# EAGLE schematic ESP32 Miner LCD-2.8 inch V1.0 251225(1) (EAGLE 9.5.1)
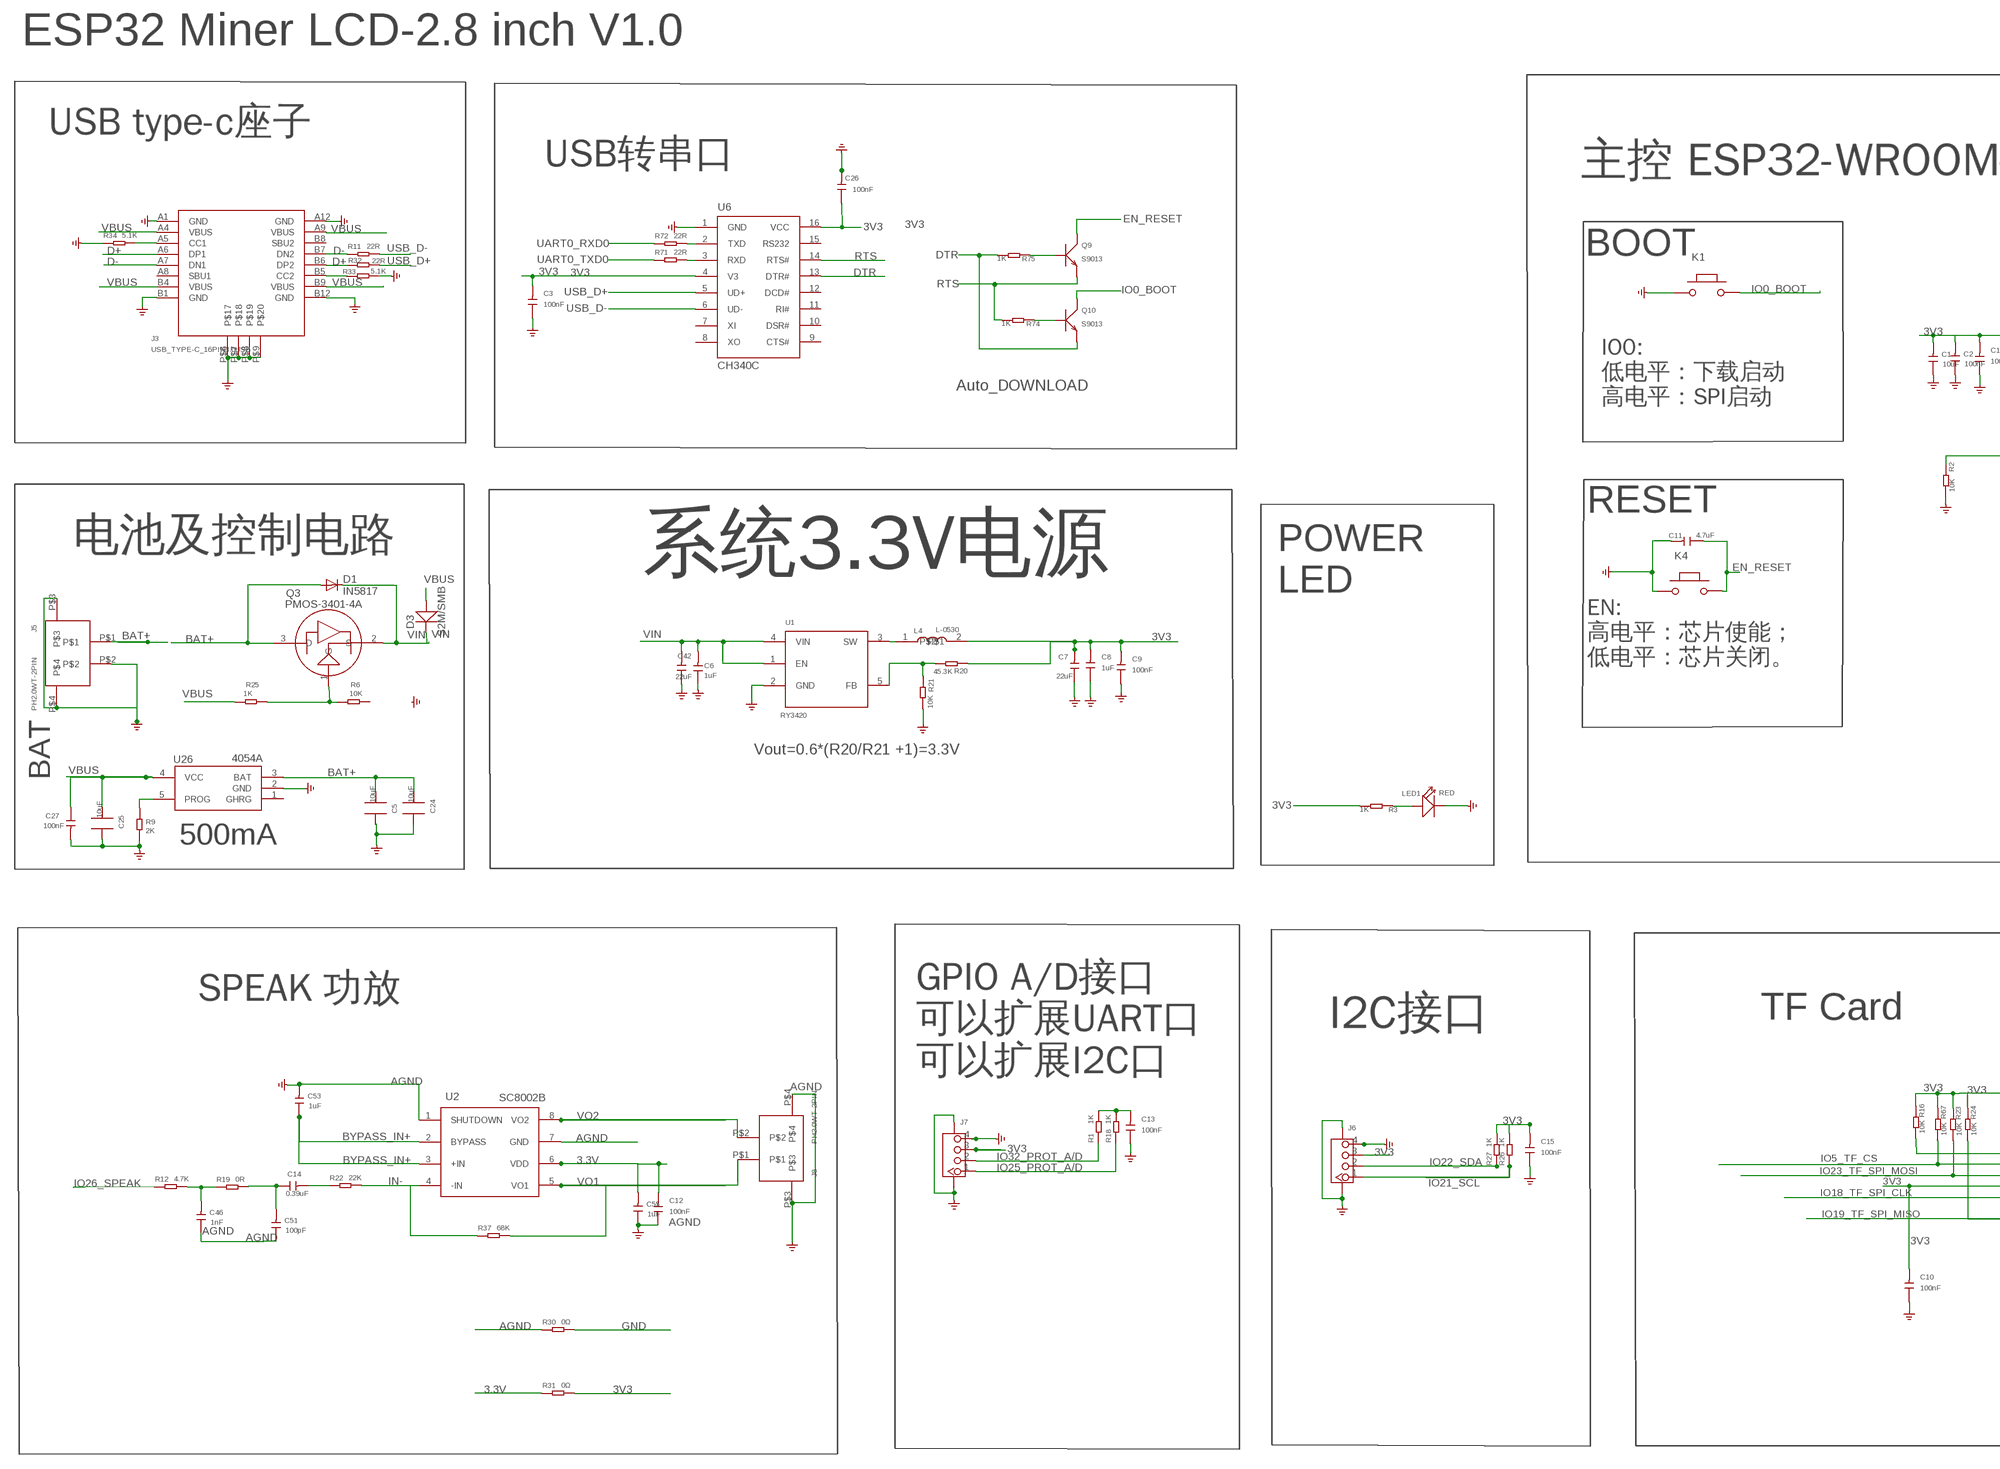
[diagram p0: schematic, sheet 1, part 1 of 2]
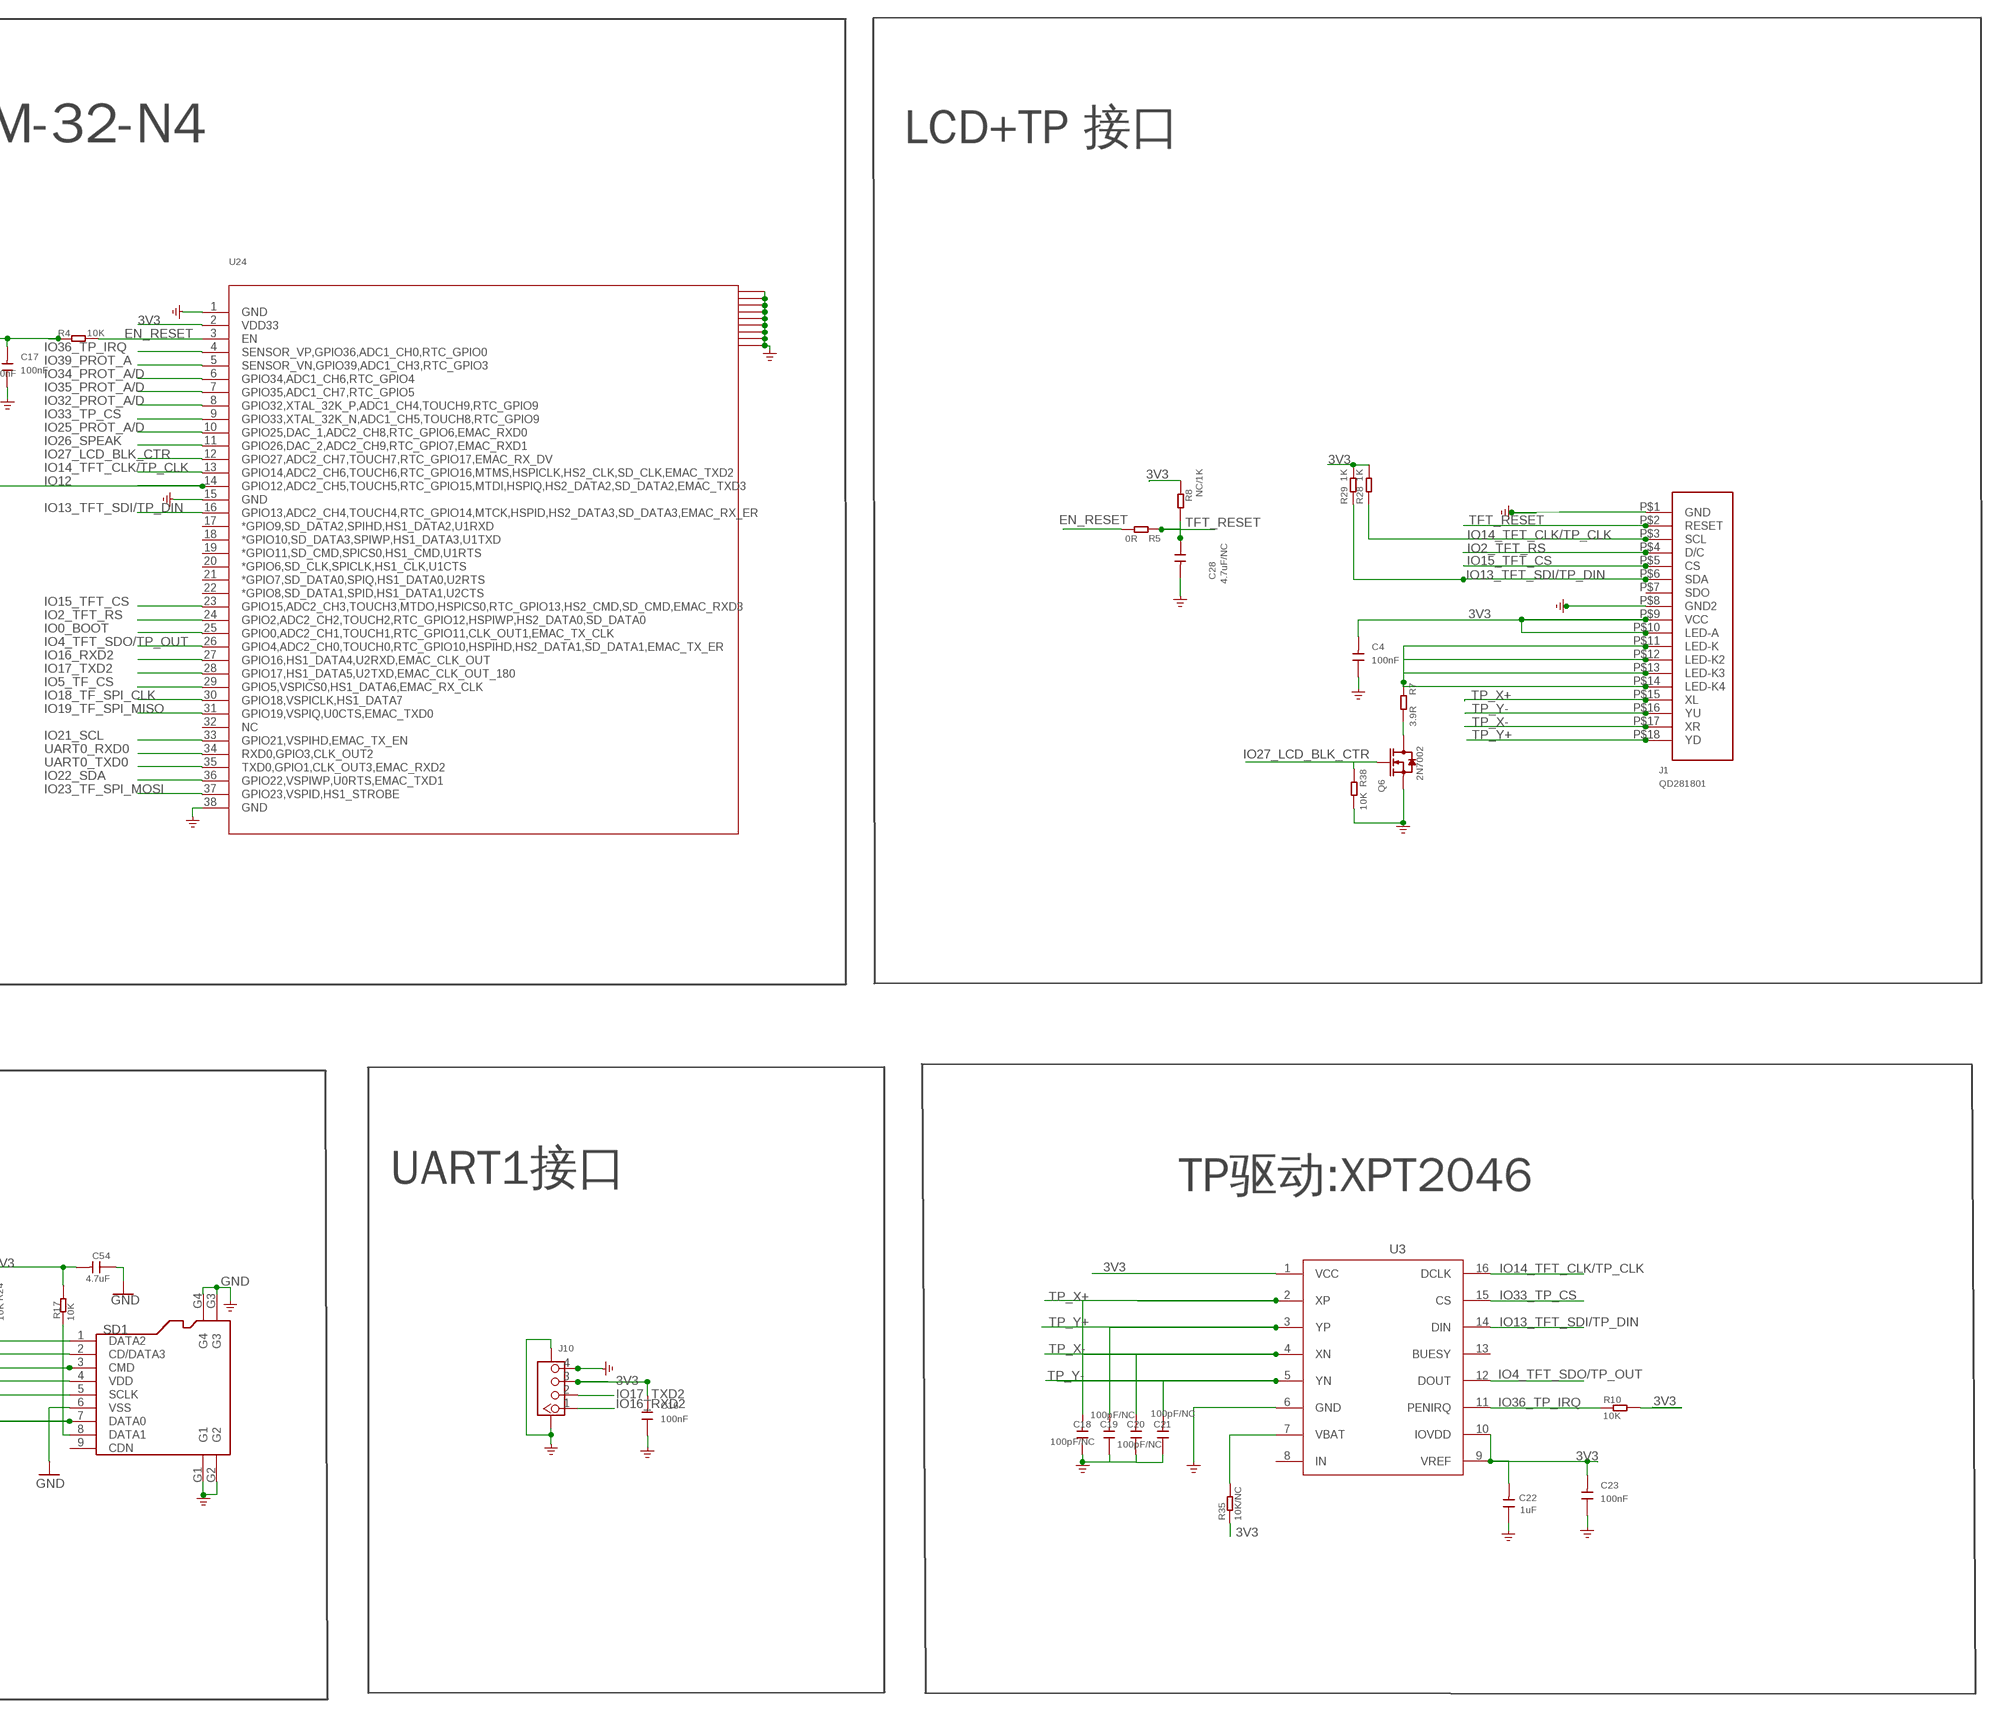
[diagram p1: schematic, sheet 1, part 2 of 2]

## Parts
C1  10uF  DISCRETE_C-0603  [DISCRETE_C0603]
C2  100nF  DISCRETE_C-0603  [DISCRETE_C0603]
C3  100nF  C0603  [0603]
C4  100nF  C0603  [0603]
C5  10uF  C0805_S  [0805_S]
C6  1uF  C0603  [0603]
C7  22uF  C0805  [0805]
C8  1uF  C0603  [0603]
C9  100nF  C0603  [0603]
C10  100nF  C0603  [0603]
C11  4.7uF  C0603  [0603]
C12  100nF  C0603  [0603]
C13  100nF  C0603  [0603]
C14  0.39uF  DISCRETE_C-0603  [DISCRETE_C0603]
C15  100nF  C0603  [0603]
C16  100nF  C0603  [0603]
C17  100nF  C0603  [0603]
C18  100pF/NC  C0603  [0603]
C19  100pF/NC  C0603  [0603]
C20  100pF/NC  C0603  [0603]
C21  100pF/NC  C0603  [0603]
C22  1uF  DISCRETE_C-0603  [DISCRETE_C0603]
C23  100nF  C0603  [0603]
C24  10uF  C0805_S  [0805_S]
C25  10uF  C0805_S  [0805_S]
C26  100nF  C0603  [0603]
C27  100nF  C-0603  [C0603]
C28  4.7uF/NC  C0603  [0603]
C42  22uF  C0805  [0805]
C46  1nF  DISCRETE_C-0603  [DISCRETE_C0603]
C51  100pF  DISCRETE_C-0603  [DISCRETE_C0603]
C53  1uF  DISCRETE_C-0603  [DISCRETE_C0603]
C54  4.7uF  DISCRETE_C-0603  [DISCRETE_C0603]
C55  1uF  DISCRETE_C-0603  [DISCRETE_C0603]
D1  IN5817  DIODE-DO-214AC  [DO-214AC]
D3  S2M/SMB  214ABDO-214AB  [214AB]
J1  QD281801  [QD241801-18PIN*0.8]
J3  USB_TYPE-C_16PIN3.0USB  [KEVIN_3.0TYPEC-SMD]
J5  PH2.0WT-2PIN  [PH2.0WT-2PIN]
J6  CONNECTOR_TWIG-4P-2.0-SMD-FEMALE-REINFORCE90D  [CONNECTOR_4P-SMD-2.0-90D]
J7  CONNECTOR_TWIG-4P-2.0-SMD-FEMALE-REINFORCE90D  [CONNECTOR_4P-SMD-2.0-90D]
J8  PH2.0WT-2PIN  [PH2.0WT-2PIN]
J10  CONNECTOR_TWIG-4P-2.0-SMD-FEMALE-REINFORCE90D  [CONNECTOR_4P-SMD-2.0-90D]
K1  BUTTON  PB157  [157SW]
K4  BUTTON  PB157  [157SW]
L4  L-0530  [CD54_CD54]
LED1  RED  DISCRETE_LED0603  [DISCRETE_LED-0603]
Q3  PMOS-3401-4A  P-MOS-SOT23  [SOT-23]
Q6  2N7002  MOSFET-N'SOT23'  [SOT23]
Q9  S9013  TRANSISTOR-NPN-SOT23  [SOT23@1]
Q10  S9013  TRANSISTOR-NPN-SOT23  [SOT23@1]
R1  1K  DISCRETE_R-0603  [DISCRETE_R0603]
R2  10K  DISCRETE_R-0603  [DISCRETE_R0603]
R3  1K  DISCRETE_R-0603  [DISCRETE_R0603]
R4  10K  R0603  [R0603]
R5  0R  DISCRETE_R-0603  [DISCRETE_R0603]
R6  10K  DISCRETE_R-0603  [DISCRETE_R0603]
R7  3.9R  DISCRETE_R-0603  [DISCRETE_R0603]
R8  NC/1K  DISCRETE_R-0603  [DISCRETE_R0603]
R9  2K  DISCRETE_R-0603  [DISCRETE_R0603]
R10  10K  DISCRETE_R-0603  [DISCRETE_R0603]
R11  22R  DISCRETE_R-0603  [DISCRETE_R0603]
R12  4.7K  DISCRETE_R-0603  [DISCRETE_R0603]
R16  10K  DISCRETE_R-0603  [DISCRETE_R0603]
R17  10K  DISCRETE_R-0603  [DISCRETE_R0603]
R18  1K  DISCRETE_R-0603  [DISCRETE_R0603]
R19  0R  DISCRETE_R-0603  [DISCRETE_R0603]
R20  45.3K  DISCRETE_R-0603  [DISCRETE_R0603]
R21  10K  DISCRETE_R-0603  [DISCRETE_R0603]
R22  22K  DISCRETE_R-0603  [DISCRETE_R0603]
R23  10K  DISCRETE_R-0603  [DISCRETE_R0603]
R24  10K  DISCRETE_R-0603  [DISCRETE_R0603]
R25  1K  DISCRETE_R-0603  [DISCRETE_R0603]
R26  1K  DISCRETE_R-0603  [DISCRETE_R0603]
R27  1K  DISCRETE_R-0603  [DISCRETE_R0603]
R28  1K  DISCRETE_R-0603  [DISCRETE_R0603]
R29  1K  DISCRETE_R-0603  [DISCRETE_R0603]
R30  0Ω  DISCRETE_R-0603  [DISCRETE_R0603]
R31  0Ω  DISCRETE_R-0603  [DISCRETE_R0603]
R32  22R  DISCRETE_R-0603  [DISCRETE_R0603]
R33  5.1K  DISCRETE_R-0603  [DISCRETE_R0603]
R34  5.1K  DISCRETE_R-0603  [DISCRETE_R0603]
R35  10K/NC  DISCRETE_R-0603  [DISCRETE_R0603]
R37  68K  DISCRETE_R-0603  [DISCRETE_R0603]
R38  10K  DISCRETE_R-0603  [DISCRETE_R0603]
R67  10K  DISCRETE_R-0603  [DISCRETE_R0603]
R71  22R  DISCRETE_R-0603  [DISCRETE_R0603]
R72  22R  DISCRETE_R-0603  [DISCRETE_R0603]
R74  1K  DISCRETE_R-0603  [DISCRETE_R0603]
R75  1K  DISCRETE_R-0603  [DISCRETE_R0603]
SD1  HOLDER-MICROSD-9P  [9P-SMD-W/-RING]
U1  RY3420  A_XBJ_HM3420B  [A_XBJ_SOT23-5]
U2  SC8002B  SC8002BSC8002B-SOP8  [AT24C02_SOP8]
U3  XP2046  [XP2046-SSOP16]
U6  CH340C  CH340G  [SOP-16]
U24  ESP32-WROOM-32-N4  [ESP32-WROOM-32-N4]
U26  4054A  [SOP23-5]

## Nets
3.3V: C12.2 C55.2 R31.1 U2.6(VDD)
3V3: C1.2 C2.2 C3.2 C4.2 C7.2 C8.2 C9.2 C10.2 C13.2 C15.2 C16.2 C17.2 C22.2 C23.2 C26.1 C54.2 J1.P$9(VCC) J1.P$10(LED-A) J6.3 J7.3 J10.3 L4.2 R1.2 R3.2 R4.1 R8.2 R10.2 R16.1 R17.1 R18.2 R20.1 R23.1 R24.1 R26.2 R27.2 R28.2 R29.2 R31.2 R35.1 R67.1 SD1.4(VDD) U3.1(VCC) U3.9(VREF) U3.10(IOVDD) U6.4(V3) U6.16(VCC) U24.2(VDD33)
AGND: C12.1 C46.1 C51.1 C53.2 C55.1 J8.P$3 J8.P$4 R30.1 U2.1(SHUTDOWN) U2.7(GND) ; supply symbol labelled GND
BAT+: C5.2 C24.2 D1.A J5.P$1 Q3.3(D) U26.3(BAT)
BYPASS_IN+: C53.1 U2.2(BYPASS) U2.3(+IN)
D+: J3.A6(DP1) J3.B6(DP2) R32.1
D-: J3.A7(DN1) J3.B7(DN2) R11.1
DTR: Q10.2(E) R75.2 U6.13(DTR#)
EN_RESET: C11.1 K4.2 Q9.3(C) R4.2 R5.2 U24.3(EN)
GND: C1.1 C2.1 C3.1 C4.1 C5.1 C6.1 C7.1 C8.1 C9.1 C10.1 C11.2 C13.1 C15.1 C16.1 C17.1 C18.1 C19.1 C20.1 C21.1 C22.1 C23.1 C24.1 C25.1 C26.2 C27.2 C28.2 C42.1 C54.1 J1.P$1(GND) J1.P$8(GND2) J3.A1(GND) J3.A12(GND) J3.B1(GND) J3.B12(GND) J3.P$6 J3.P$7 J3.P$8 J3.P$9 J5.P$2 J5.P$3 J5.P$4 J6.4 J6.SS1 J6.SS2 J7.4 J7.SS1 J7.SS2 J10.4 J10.SS1 J10.SS2 K1.1 K4.1 LED1.- Q6.2(S) R2.2 R9.2 R21.2 R30.2 R33.2 R34.1 R38.2 SD1.6(VSS) SD1.G1 SD1.G2 SD1.G3 SD1.G4 U1.2(GND) U3.6(GND) U6.1(GND) U24.1(GND) U24.15(GND) U24.38(GND) U24.41(GND) U24.42(GND) U24.43(GND) U24.44(GND) U24.45(GND) U24.46(GND) U24.47(GND) U24.48(GND) U24.49(GND) U26.2(GND)
IN-: R22.2 R37.1 U2.4(-IN)
IO0_BOOT: K1.2 Q10.3(C) U24.25(GPIO0,ADC2_CH1,TOUCH1,RTC_GPIO11,CLK_OUT1,EMAC_TX_CLK)
IO2_TFT_RS: J1.P$4(D/C) U24.24(GPIO2,ADC2_CH2,TOUCH2,RTC_GPIO12,HSPIWP,HS2_DATA0,SD_DATA0)
IO4_TFT_SDO/TP_OUT: U3.12(DOUT) U24.26(GPIO4,ADC2_CH0,TOUCH0,RTC_GPIO10,HSPIHD,HS2_DATA1,SD_DATA1,EMAC_TX_ER)
IO5_TF_CS: R67.2 SD1.2(CD/DATA3) U24.29(GPIO5,VSPICS0,HS1_DATA6,EMAC_RX_CLK)
IO12: R2.1 U24.14(GPIO12,ADC2_CH5,TOUCH5,RTC_GPIO15,MTDI,HSPIQ,HS2_DATA2,SD_DATA2,EMAC_TXD3)
IO13_TFT_SDI/TP_DIN: J1.P$6(SDA) R29.1 U3.14(DIN) U24.16(GPIO13,ADC2_CH4,TOUCH4,RTC_GPIO14,MTCK,HSPID,HS2_DATA3,SD_DATA3,EMAC_RX_ER)
IO14_TFT_CLK/TP_CLK: J1.P$3(SCL) R28.1 U3.16(DCLK) U24.13(GPIO14,ADC2_CH6,TOUCH6,RTC_GPIO16,MTMS,HSPICLK,HS2_CLK,SD_CLK,EMAC_TXD2)
IO15_TFT_CS: J1.P$5(CS) U24.23(GPIO15,ADC2_CH3,TOUCH3,MTDO,HSPICS0,RTC_GPIO13,HS2_CMD,SD_CMD,EMAC_RXD3)
IO16_RXD2: J10.1 U24.27(GPIO16,HS1_DATA4,U2RXD,EMAC_CLK_OUT)
IO17_TXD2: J10.2 U24.28(GPIO17,HS1_DATA5,U2TXD,EMAC_CLK_OUT_180)
IO18_TF_SPI_CLK: SD1.5(SCLK) U24.30(GPIO18,VSPICLK,HS1_DATA7)
IO19_TF_SPI_MISO: R24.2 SD1.7(DATA0) U24.31(GPIO19,VSPIQ,U0CTS,EMAC_TXD0)
IO21_SCL: J6.1 R26.1 U24.33(GPIO21,VSPIHD,EMAC_TX_EN)
IO22_SDA: J6.2 R27.1 U24.36(GPIO22,VSPIWP,U0RTS,EMAC_TXD1)
IO23_TF_SPI_MOSI: R23.2 SD1.3(CMD) U24.37(GPIO23,VSPID,HS1_STROBE)
IO25_PROT_A/D: J7.1 R18.1 U24.10(GPIO25,DAC_1,ADC2_CH8,RTC_GPIO6,EMAC_RXD0)
IO26_SPEAK: R12.1 U24.11(GPIO26,DAC_2,ADC2_CH9,RTC_GPIO7,EMAC_RXD1)
IO27_LCD_BLK_CTR: Q6.1(G) R38.1 U24.12(GPIO27,ADC2_CH7,TOUCH7,RTC_GPIO17,EMAC_RX_DV)
IO32_PROT_A/D: J7.2 R1.1 U24.8(GPIO32,XTAL_32K_P,ADC1_CH4,TOUCH9,RTC_GPIO9)
IO33_TP_CS: U3.15(CS) U24.9(GPIO33,XTAL_32K_N,ADC1_CH5,TOUCH8,RTC_GPIO9)
IO34_PROT_A/D: U24.6(GPIO34,ADC1_CH6,RTC_GPIO4)
IO35_PROT_A/D: U24.7(GPIO35,ADC1_CH7,RTC_GPIO5)
IO36_TP_IRQ: R10.1 U3.11(PENIRQ) U24.4(SENSOR_VP,GPIO36,ADC1_CH0,RTC_GPIO0)
IO39_PROT_A: U24.5(SENSOR_VN,GPIO39,ADC1_CH3,RTC_GPIO3)
N$1: LED1.+ R3.1
N$2: Q6.3(D) R7.2
N$3: C46.2 R12.2 R19.1
N$4: R35.2 U3.7(VBAT)
N$6: R9.1 U26.5(PROG)
N$8: L4.1 U1.3(SW)
N$12: J1.P$11(LED-K) J1.P$12(LED-K2) J1.P$13(LED-K3) J1.P$14(LED-K4) R7.1
N$14: J3.B5(CC2) R33.1
N$16: J3.A5(CC1) R34.2
N$17: Q3.1(G) R6.2 R25.1
N$20: R20.2 R21.1 U1.5(FB)
N$26: C14.1 C51.2 R19.2
N$29: C14.2 R22.1
N$32: Q9.1(B) R75.1
N$38: Q10.1(B) R74.1
N$40: R72.2 U6.2(TXD)
N$42: R71.2 U6.3(RXD)
N$47: R16.2 SD1.1(DATA2)
N$48: R17.2 SD1.8(DATA1)
RTS: Q9.2(E) R74.2 U6.14(RTS#)
TFT_RESET: C28.1 J1.P$2(RESET) R5.1 R8.1
TP_X+: C18.2 J1.P$15(XL) U3.2(XP)
TP_X-: C20.2 J1.P$17(XR) U3.4(XN)
TP_Y+: C19.2 J1.P$18(YD) U3.3(YP)
TP_Y-: C21.2 J1.P$16(YU) U3.5(YN)
UART0_RXD0: R72.1 U24.34(RXD0,GPIO3,CLK_OUT2)
UART0_TXD0: R71.1 U24.35(TXD0,GPIO1,CLK_OUT3,EMAC_RXD2)
USB_D+: R32.2 U6.5(UD+)
USB_D-: R11.2 U6.6(UD-)
VBUS: C25.2 C27.1 D3.1(+) J3.A4(VBUS) J3.A9(VBUS) J3.B4(VBUS) J3.B9(VBUS) R25.2 U26.4(VCC)
VIN: C6.2 C42.2 D1.C D3.2(-) Q3.2(S) U1.1(EN) U1.4(VIN)
VO1: J8.P$1 R37.2 U2.5(VO1)
VO2: J8.P$2 U2.8(VO2)
Unconnected: J1.P$7(SDO) J3.A8(SBU1) J3.B8(SBU2) R6.1 SD1.9(CDN) U3.8(IN) U3.13(BUESY) U6.7(XI) U6.8(XO) U6.9(CTS#) U6.10(DSR#) U6.11(RI#) U6.12(DCD#) U6.15(RS232) U24.17(*GPIO9,SD_DATA2,SPIHD,HS1_DATA2,U1RXD) U24.18(*GPIO10,SD_DATA3,SPIWP,HS1_DATA3,U1TXD) U24.19(*GPIO11,SD_CMD,SPICS0,HS1_CMD,U1RTS) U24.20(*GPIO6,SD_CLK,SPICLK,HS1_CLK,U1CTS) U24.21(*GPIO7,SD_DATA0,SPIQ,HS1_DATA0,U2RTS) U24.22(*GPIO8,SD_DATA1,SPID,HS1_DATA1,U2CTS) U24.32(NC) U26.1(GHRG)

## Notes on the sheet
- ESP32 Miner LCD-2.8 inch V1.0
- USB type-c座子
- USB转串口 | 主控 ESP32-WROOM-32-N4 | LCD+TP 接口
- BOOT
- Auto_DOWNLOAD
- IO0:
  低电平：下载启动
  高电平：SPI启动
- RESET
- 电池及控制电路
- 系统3.3V电源
- POWER
  LED
- EN:
  高电平：芯片使能；
  低电平：芯片关闭。
- Vout=0.6*(R20/R21 +1)=3.3V
- BAT
- 500mA
- SPEAK 功放
- I2C接口 | TF Card | UART1接口
- TP驱动:XPT2046
- GPIO A/D接口
  可以扩展UART口
  可以扩展I2C口

## Library data of the parts
C1 C2 C14 C22 C46 C51 C53 C55 = A_xbj:DISCRETE_C*: Ceramic Capacitors
C3 C4 C6 C8-C13 C15-C21 C23 C26 C28 = A_xbj:C0603
C5 C24 C25 = CPT_SMD:C0805
C7 C42 = A_xbj:C0805
C27 = discrete:C*: Ceramic Capacitors
C54 = A9G:DISCRETE_C*: Ceramic Capacitors
D1 = diode:DIODE-: DIODE
D3 = DO-214AB:214AB: 214AB
J1 = cooper:QD281801
J3 = WZ3532R024-ESP32-V0.1-20221226:USB_TYPE-C_16PIN
J5 J8 = cooper:PH2.0WT-2PIN
J6 J7 J10 = A_xbj:CONNECTOR_TWIG-4P-2.0-SMD-FEMALE-REINFORCE
K1 K4 = MySMD:PB157
L4 = WZ2432R028-ESP32-V1.2-20231108:L-0530
LED1 = A_xbj:DISCRETE_LED*
Q3 = DFN8:P-MOS-SOT23
Q6 = discrete:MOSFET-N: IRLL014: http://www.vishay.com/docs/91319/sihll014.pdf
Q9 Q10 = discrete:TRANSISTOR-NPN*: NPN audion
R1-R3 R5 R7 R8 R11 R12 R16-R24 R26-R34 R37 R38 R67 R71 R72 R74 R75 = Crowtail-_LED-V2.0-20190615-01:DISCRETE_R*
R4 = A_xbj:R0603
R6 R9 R10 R25 R35 = A9G:DISCRETE_R*
SD1 = Connector:HOLDER-MICROSD-9P
U1 = CrowBot_-V1.0-20220525:A_XBJ_HM3420B
U2 = cooper:SC8002B
U3 = cooper:XP2046
U6 = A_xbj:CH340G
U24 = cooper:ESP32-WROOM-32-N4
U26 = DFN8:4054A

## Net classes
0 default: width 0.152 mm, drill 0.305 mm, clearance 0.203 mm